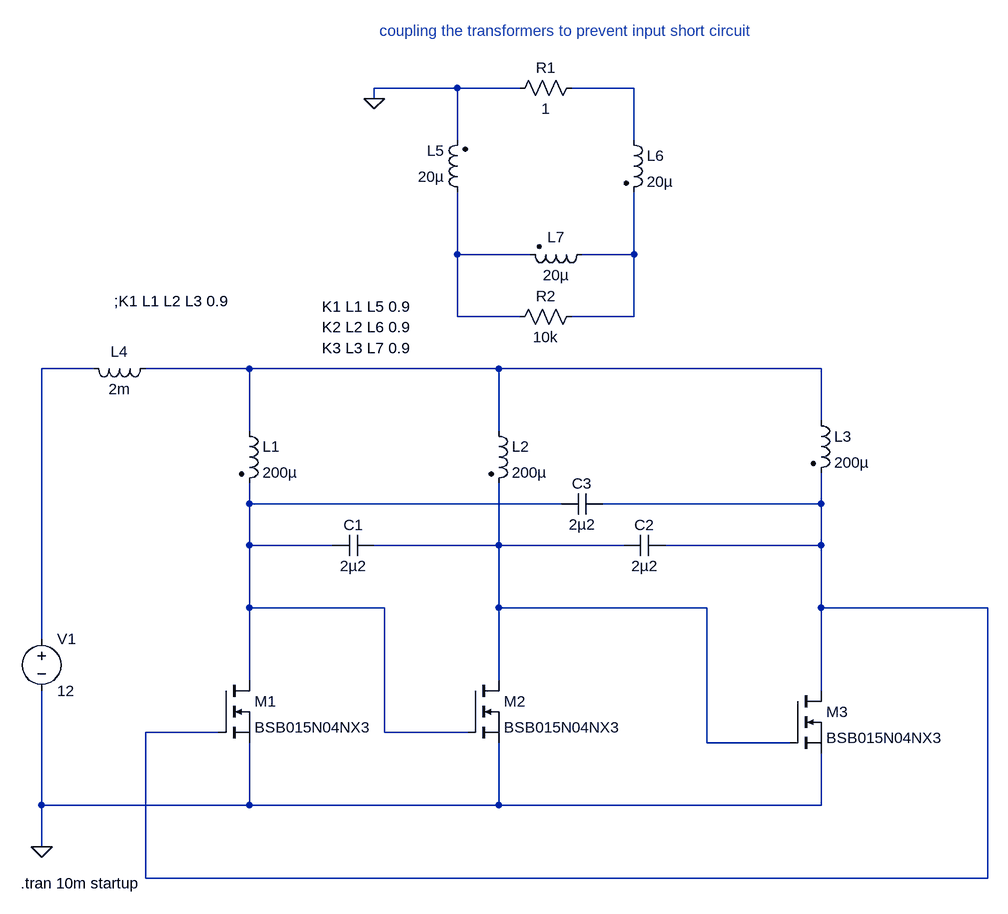
[diagram p0: schematic reso3phasestarcoils.asc]
reso3phasestarcoils.asc, the LTspice schematic file:
Version 4
SHEET 1 1524 680
WIRE 704 -880 576 -880
WIRE 800 -880 704 -880
WIRE 976 -880 880 -880
WIRE 576 -864 576 -880
WIRE 704 -800 704 -880
WIRE 976 -800 976 -880
WIRE 704 -624 704 -720
WIRE 816 -624 704 -624
WIRE 976 -624 976 -720
WIRE 976 -624 896 -624
WIRE 704 -528 704 -624
WIRE 800 -528 704 -528
WIRE 976 -528 976 -624
WIRE 976 -528 880 -528
WIRE 144 -448 64 -448
WIRE 384 -448 224 -448
WIRE 768 -448 384 -448
WIRE 1264 -448 768 -448
WIRE 1264 -368 1264 -448
WIRE 384 -352 384 -448
WIRE 768 -352 768 -448
WIRE 384 -240 384 -272
WIRE 864 -240 384 -240
WIRE 1264 -240 1264 -288
WIRE 1264 -240 928 -240
WIRE 384 -176 384 -240
WIRE 512 -176 384 -176
WIRE 768 -176 768 -272
WIRE 768 -176 576 -176
WIRE 960 -176 768 -176
WIRE 1264 -176 1264 -240
WIRE 1264 -176 1024 -176
WIRE 384 -80 384 -176
WIRE 592 -80 384 -80
WIRE 768 -80 768 -176
WIRE 1088 -80 768 -80
WIRE 1264 -80 1264 -176
WIRE 1520 -80 1264 -80
WIRE 64 -32 64 -448
WIRE 384 32 384 -80
WIRE 768 32 768 -80
WIRE 1264 48 1264 -80
WIRE 336 112 224 112
WIRE 592 112 592 -80
WIRE 720 112 592 112
WIRE 1088 128 1088 -80
WIRE 1216 128 1088 128
WIRE 64 224 64 48
WIRE 384 224 384 128
WIRE 384 224 64 224
WIRE 768 224 768 128
WIRE 768 224 384 224
WIRE 1264 224 1264 144
WIRE 1264 224 768 224
WIRE 64 288 64 224
WIRE 224 336 224 112
WIRE 1520 336 1520 -80
WIRE 1520 336 224 336
FLAG 64 288 0
FLAG 576 -864 0
SYMBOL voltage 64 -48 R0
WINDOW 123 0 0 Left 2
WINDOW 39 0 0 Left 2
SYMATTR InstName V1
SYMATTR Value 12
SYMBOL nmos 336 32 R0
SYMATTR InstName M1
SYMATTR Value BSB015N04NX3
SYMBOL nmos 720 32 R0
SYMATTR InstName M2
SYMATTR Value BSB015N04NX3
SYMBOL nmos 1216 48 R0
SYMATTR InstName M3
SYMATTR Value BSB015N04NX3
SYMBOL ind2 368 -368 R0
SYMATTR InstName L1
SYMATTR Value 200µ
SYMATTR Type ind
SYMATTR SpiceLine Rser=0.001
SYMBOL ind2 752 -368 R0
SYMATTR InstName L2
SYMATTR Value 200µ
SYMATTR Type ind
SYMBOL ind2 1248 -384 R0
SYMATTR InstName L3
SYMATTR Value 200µ
SYMATTR Type ind
SYMBOL cap 576 -192 R90
WINDOW 0 0 32 VBottom 2
WINDOW 3 32 32 VTop 2
SYMATTR InstName C1
SYMATTR Value 2µ2
SYMBOL cap 1024 -192 R90
WINDOW 0 0 32 VBottom 2
WINDOW 3 32 32 VTop 2
SYMATTR InstName C2
SYMATTR Value 2µ2
SYMBOL cap 928 -256 R90
WINDOW 0 0 32 VBottom 2
WINDOW 3 32 32 VTop 2
SYMATTR InstName C3
SYMATTR Value 2µ2
SYMBOL ind 240 -464 R90
WINDOW 0 5 56 VBottom 2
WINDOW 3 32 56 VTop 2
SYMATTR InstName L4
SYMATTR Value 2m
SYMBOL ind2 720 -704 R180
WINDOW 0 36 80 Left 2
WINDOW 3 36 40 Left 2
SYMATTR InstName L5
SYMATTR Value 20µ
SYMATTR Type ind
SYMBOL ind2 960 -816 R0
SYMATTR InstName L6
SYMATTR Value 20µ
SYMATTR Type ind
SYMBOL ind2 912 -640 R90
WINDOW 0 5 56 VBottom 2
WINDOW 3 32 56 VTop 2
SYMATTR InstName L7
SYMATTR Value 20µ
SYMATTR Type ind
SYMBOL res 896 -896 R90
WINDOW 0 0 56 VBottom 2
WINDOW 3 32 56 VTop 2
SYMATTR InstName R1
SYMATTR Value 1
SYMBOL res 896 -544 R90
WINDOW 0 0 56 VBottom 2
WINDOW 3 32 56 VTop 2
SYMATTR InstName R2
SYMATTR Value 10k
TEXT 32 344 Left 2 !.tran 10m startup
TEXT 496 -544 Left 2 !K1 L1 L5 0.9
TEXT 496 -512 Left 2 !K2 L2 L6 0.9
TEXT 496 -480 Left 2 !K3 L3 L7 0.9
TEXT 176 -552 Left 2 !;K1 L1 L2 L3 0.9
TEXT 584 -968 Left 2 ;coupling the transformers to prevent input short circuit

The netlist it stands for:
* reso3phasestarcoils.asc
V1 N004 0 12
M1 N006 N007 0 0 BSB015N04NX3
M2 N008 N006 0 0 BSB015N04NX3
M3 N007 N008 0 0 BSB015N04NX3
L1 N005 N006 200µ Rser=0.001
L2 N005 N008 200µ
L3 N005 N007 200µ
C1 N008 N006 2µ2
C2 N007 N008 2µ2
C3 N007 N006 2µ2
L4 N005 N004 2m
L5 N002 0 20µ
L6 N001 N003 20µ
L7 N003 N002 20µ
R1 N001 0 1
R2 N003 N002 10k
.model NMOS NMOS
.model PMOS PMOS
.lib standard.mos
.tran 10m startup
K1 L1 L5 0.9
K2 L2 L6 0.9
K3 L3 L7 0.9
;K1 L1 L2 L3 0.9
* coupling the transformers to prevent input short circuit
.backanno
.end